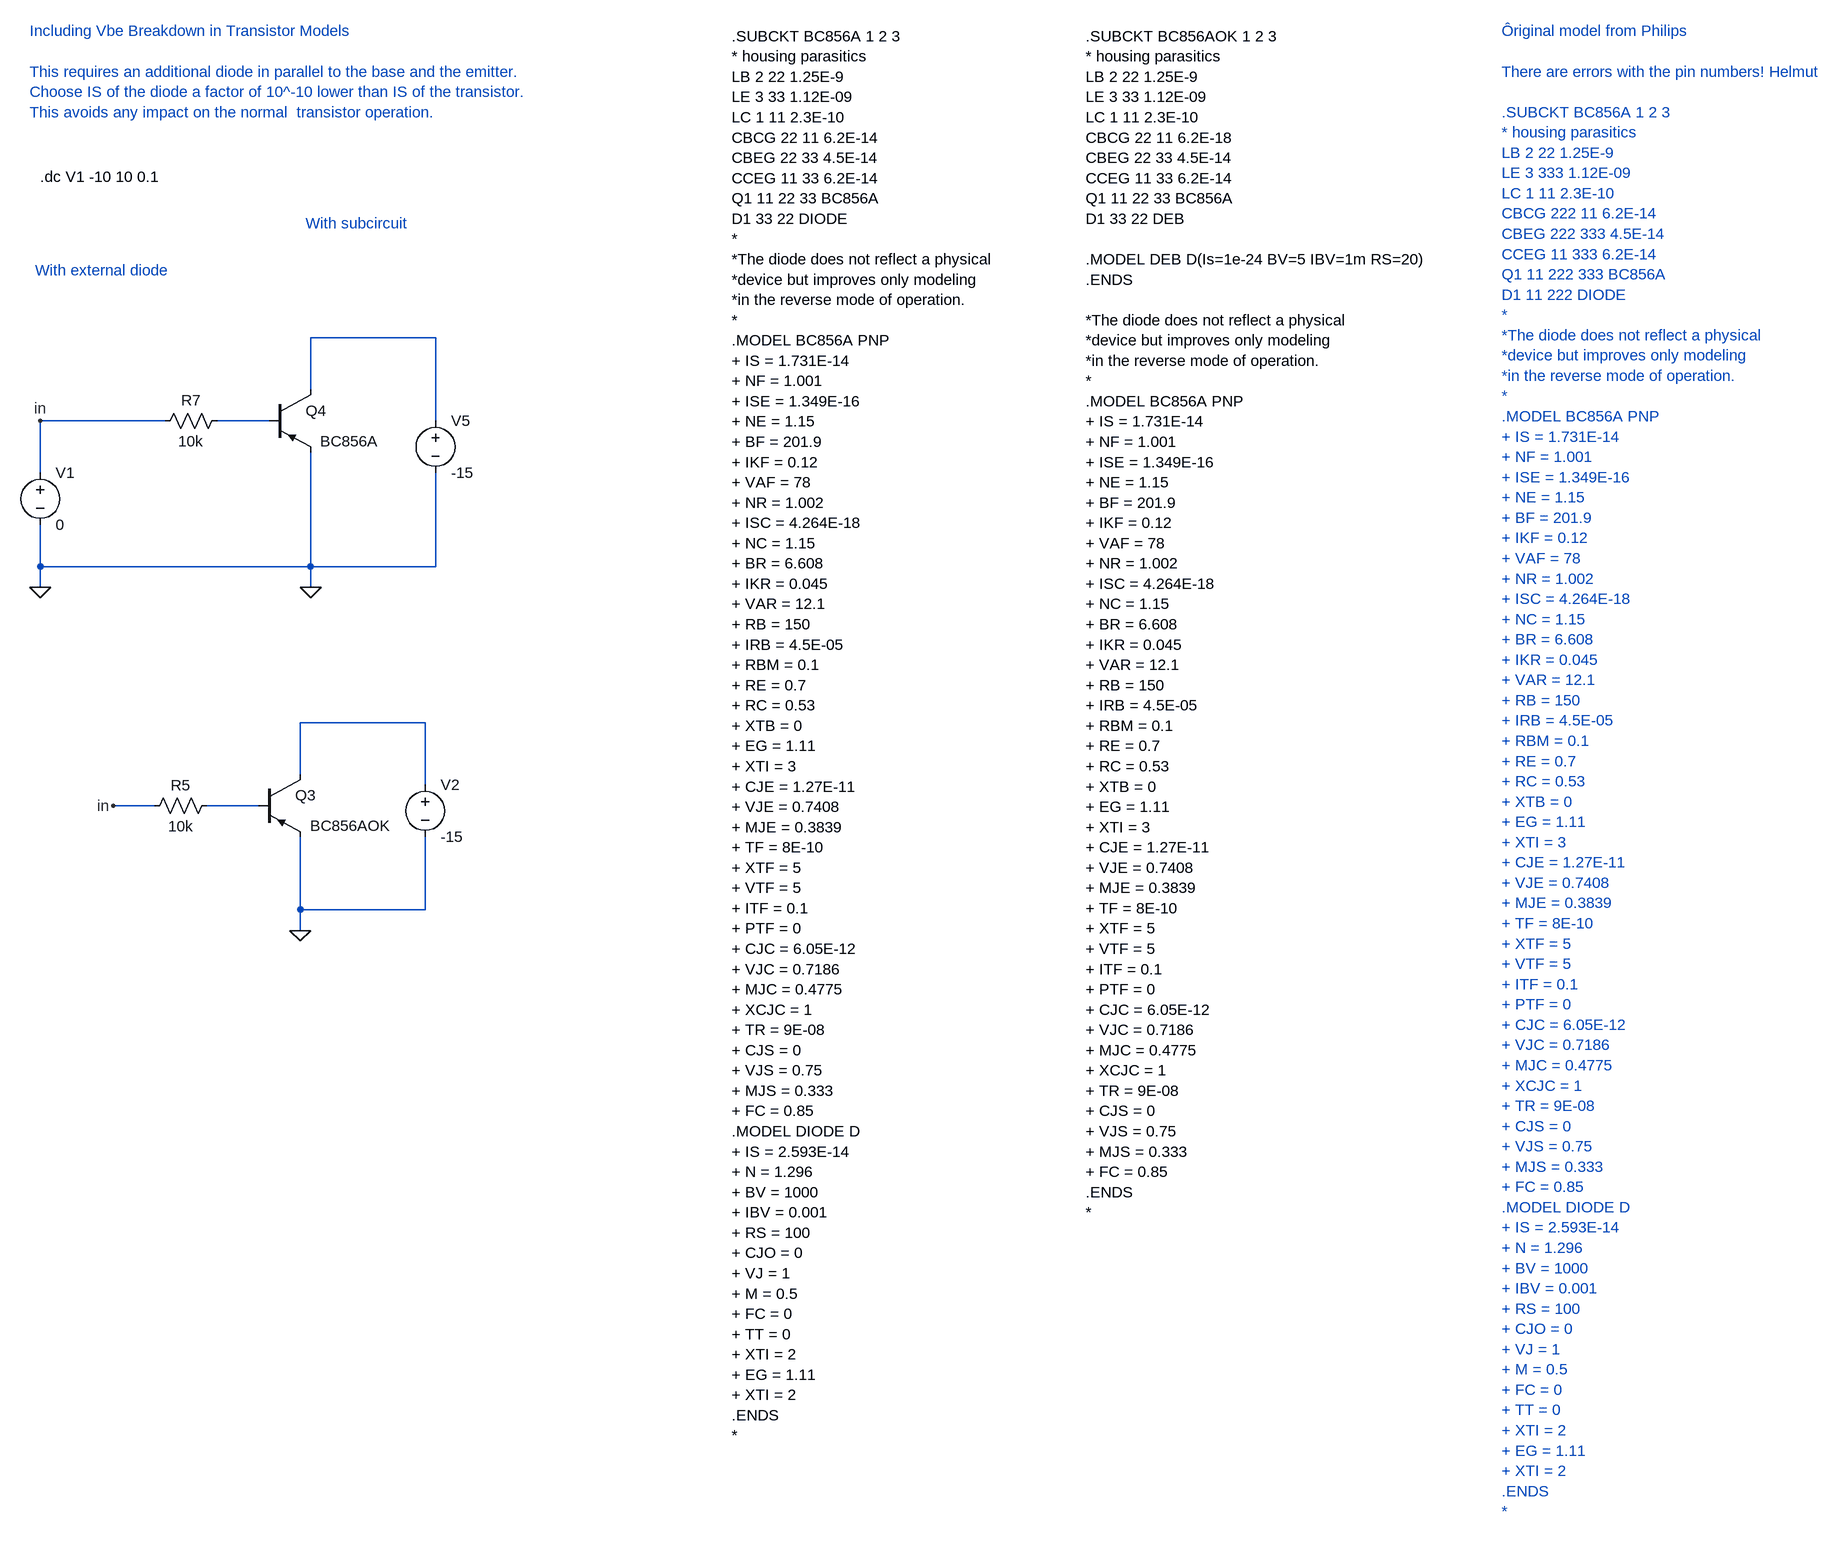
[diagram p0: schematic Vbe_break1.asc]
Vbe_break1.asc, the LTspice schematic file:
Version 4
SHEET 1 2824 2032
WIRE -128 256 -128 176
WIRE -128 400 -128 336
WIRE -128 432 -128 400
WIRE 48 768 -16 768
WIRE 64 176 -128 176
WIRE 208 768 128 768
WIRE 224 176 144 176
WIRE 272 720 272 640
WIRE 272 928 272 816
WIRE 272 960 272 928
WIRE 288 128 288 48
WIRE 288 400 -128 400
WIRE 288 400 288 224
WIRE 288 432 288 400
WIRE 464 640 272 640
WIRE 464 736 464 640
WIRE 464 928 272 928
WIRE 464 928 464 816
WIRE 480 48 288 48
WIRE 480 176 480 48
WIRE 480 400 288 400
WIRE 480 400 480 256
FLAG -128 432 0
FLAG -128 176 in
FLAG -16 768 in
FLAG 272 960 0
FLAG 288 432 0
SYMBOL voltage -128 240 R0
SYMATTR InstName V1
SYMATTR Value 0
SYMBOL res 32 784 R270
WINDOW 0 32 56 VTop 0
WINDOW 3 0 56 VBottom 0
SYMATTR InstName R5
SYMATTR Value 10k
SYMBOL pnp 208 720 R0
WINDOW 3 79 79 Left 0
SYMATTR Value BC856AOK
SYMATTR InstName Q3
SYMATTR Prefix X
SYMBOL voltage 464 720 R0
SYMATTR InstName V2
SYMATTR Value -15
SYMBOL res 48 192 R270
WINDOW 0 32 56 VTop 0
WINDOW 3 0 56 VBottom 0
SYMATTR InstName R7
SYMATTR Value 10k
SYMBOL pnp 224 128 R0
WINDOW 3 79 79 Left 0
SYMATTR Value BC856A
SYMATTR InstName Q4
SYMBOL voltage 480 160 R0
SYMATTR InstName V5
SYMATTR Value -15
TEXT -128 -200 Left 0 !.dc V1 -10 10 0.1
TEXT -136 -56 Left 0 ;With external diode
TEXT 280 -128 Left 0 ;With subcircuit
TEXT -144 -424 Left 0 ;Including Vbe Breakdown in Transistor Models\n \nThis requires an additional diode in parallel to the base and the emitter.\nChoose IS of the diode a factor of 10^-10 lower than IS of the transistor. \nThis avoids any impact on the normal  transistor operation.
TEXT 1480 -416 Left 0 !.SUBCKT BC856AOK 1 2 3\n* housing parasitics\nLB 2 22 1.25E-9\nLE 3 33 1.12E-09\nLC 1 11 2.3E-10\nCBCG 22 11 6.2E-18\nCBEG 22 33 4.5E-14\nCCEG 11 33 6.2E-14\nQ1 11 22 33 BC856A\nD1 33 22 DEB\n \n.MODEL DEB D(Is=1e-24 BV=5 IBV=1m RS=20)\n.ENDS\n \n*The diode does not reflect a physical\n*device but improves only modeling\n*in the reverse mode of operation.\n*\n.MODEL BC856A PNP\n+ IS = 1.731E-14\n+ NF = 1.001\n+ ISE = 1.349E-16\n+ NE = 1.15\n+ BF = 201.9\n+ IKF = 0.12\n+ VAF = 78\n+ NR = 1.002\n+ ISC = 4.264E-18\n+ NC = 1.15\n+ BR = 6.608\n+ IKR = 0.045\n+ VAR = 12.1\n+ RB = 150\n+ IRB = 4.5E-05\n+ RBM = 0.1\n+ RE = 0.7\n+ RC = 0.53\n+ XTB = 0\n+ EG = 1.11\n+ XTI = 3\n+ CJE = 1.27E-11\n+ VJE = 0.7408\n+ MJE = 0.3839\n+ TF = 8E-10\n+ XTF = 5\n+ VTF = 5\n+ ITF = 0.1\n+ PTF = 0\n+ CJC = 6.05E-12\n+ VJC = 0.7186\n+ MJC = 0.4775\n+ XCJC = 1\n+ TR = 9E-08\n+ CJS = 0\n+ VJS = 0.75\n+ MJS = 0.333\n+ FC = 0.85\n.ENDS\n*
TEXT 936 -416 Left 0 !.SUBCKT BC856A 1 2 3\n* housing parasitics\nLB 2 22 1.25E-9\nLE 3 33 1.12E-09\nLC 1 11 2.3E-10\nCBCG 22 11 6.2E-14\nCBEG 22 33 4.5E-14\nCCEG 11 33 6.2E-14\nQ1 11 22 33 BC856A\nD1 33 22 DIODE\n*\n*The diode does not reflect a physical\n*device but improves only modeling\n*in the reverse mode of operation.\n*\n.MODEL BC856A PNP\n+ IS = 1.731E-14\n+ NF = 1.001\n+ ISE = 1.349E-16\n+ NE = 1.15\n+ BF = 201.9\n+ IKF = 0.12\n+ VAF = 78\n+ NR = 1.002\n+ ISC = 4.264E-18\n+ NC = 1.15\n+ BR = 6.608\n+ IKR = 0.045\n+ VAR = 12.1\n+ RB = 150\n+ IRB = 4.5E-05\n+ RBM = 0.1\n+ RE = 0.7\n+ RC = 0.53\n+ XTB = 0\n+ EG = 1.11\n+ XTI = 3\n+ CJE = 1.27E-11\n+ VJE = 0.7408\n+ MJE = 0.3839\n+ TF = 8E-10\n+ XTF = 5\n+ VTF = 5\n+ ITF = 0.1\n+ PTF = 0\n+ CJC = 6.05E-12\n+ VJC = 0.7186\n+ MJC = 0.4775\n+ XCJC = 1\n+ TR = 9E-08\n+ CJS = 0\n+ VJS = 0.75\n+ MJS = 0.333\n+ FC = 0.85\n.MODEL DIODE D\n+ IS = 2.593E-14\n+ N = 1.296\n+ BV = 1000\n+ IBV = 0.001\n+ RS = 100\n+ CJO = 0\n+ VJ = 1\n+ M = 0.5\n+ FC = 0\n+ TT = 0\n+ XTI = 2\n+ EG = 1.11\n+ XTI = 2\n.ENDS\n*
TEXT 2120 -424 Left 0 ;Ôriginal model from Philips\n \nThere are errors with the pin numbers! Helmut\n \n.SUBCKT BC856A 1 2 3\n* housing parasitics\nLB 2 22 1.25E-9\nLE 3 333 1.12E-09\nLC 1 11 2.3E-10\nCBCG 222 11 6.2E-14\nCBEG 222 333 4.5E-14\nCCEG 11 333 6.2E-14\nQ1 11 222 333 BC856A\nD1 11 222 DIODE\n*\n*The diode does not reflect a physical\n*device but improves only modeling\n*in the reverse mode of operation.\n*\n.MODEL BC856A PNP\n+ IS = 1.731E-14\n+ NF = 1.001\n+ ISE = 1.349E-16\n+ NE = 1.15\n+ BF = 201.9\n+ IKF = 0.12\n+ VAF = 78\n+ NR = 1.002\n+ ISC = 4.264E-18\n+ NC = 1.15\n+ BR = 6.608\n+ IKR = 0.045\n+ VAR = 12.1\n+ RB = 150\n+ IRB = 4.5E-05\n+ RBM = 0.1\n+ RE = 0.7\n+ RC = 0.53\n+ XTB = 0\n+ EG = 1.11\n+ XTI = 3\n+ CJE = 1.27E-11\n+ VJE = 0.7408\n+ MJE = 0.3839\n+ TF = 8E-10\n+ XTF = 5\n+ VTF = 5\n+ ITF = 0.1\n+ PTF = 0\n+ CJC = 6.05E-12\n+ VJC = 0.7186\n+ MJC = 0.4775\n+ XCJC = 1\n+ TR = 9E-08\n+ CJS = 0\n+ VJS = 0.75\n+ MJS = 0.333\n+ FC = 0.85\n.MODEL DIODE D\n+ IS = 2.593E-14\n+ N = 1.296\n+ BV = 1000\n+ IBV = 0.001\n+ RS = 100\n+ CJO = 0\n+ VJ = 1\n+ M = 0.5\n+ FC = 0\n+ TT = 0\n+ XTI = 2\n+ EG = 1.11\n+ XTI = 2\n.ENDS\n*

The netlist it stands for:
* Vbe_break1.asc
V1 in 0 0
R5 in N001 10k
XQ3 N003 N001 0 BC856AOK  ; pins C B E
V2 N003 0 -15
R7 in N002 10k
Q4 N004 N002 0 0 BC856A
V5 N004 0 -15
.model NPN NPN
.model PNP PNP
.lib standard.bjt
.dc V1 -10 10 0.1
* With external diode
* With subcircuit
* Including Vbe Breakdown in Transistor Models
* This requires an additional diode in parallel to the base and the emitter.
* Choose IS of the diode a factor of 10^-10 lower than IS of the transistor.
* This avoids any impact on the normal  transistor operation.
.SUBCKT BC856AOK 1 2 3
* housing parasitics
LB 2 22 1.25E-9
LE 3 33 1.12E-09
LC 1 11 2.3E-10
CBCG 22 11 6.2E-18
CBEG 22 33 4.5E-14
CCEG 11 33 6.2E-14
Q1 11 22 33 BC856A
D1 33 22 DEB
.MODEL DEB D(Is=1e-24 BV=5 IBV=1m RS=20)
.ENDS
*The diode does not reflect a physical
*device but improves only modeling
*in the reverse mode of operation.
*
.MODEL BC856A PNP
+ IS = 1.731E-14
+ NF = 1.001
+ ISE = 1.349E-16
+ NE = 1.15
+ BF = 201.9
+ IKF = 0.12
+ VAF = 78
+ NR = 1.002
+ ISC = 4.264E-18
+ NC = 1.15
+ BR = 6.608
+ IKR = 0.045
+ VAR = 12.1
+ RB = 150
+ IRB = 4.5E-05
+ RBM = 0.1
+ RE = 0.7
+ RC = 0.53
+ XTB = 0
+ EG = 1.11
+ XTI = 3
+ CJE = 1.27E-11
+ VJE = 0.7408
+ MJE = 0.3839
+ TF = 8E-10
+ XTF = 5
+ VTF = 5
+ ITF = 0.1
+ PTF = 0
+ CJC = 6.05E-12
+ VJC = 0.7186
+ MJC = 0.4775
+ XCJC = 1
+ TR = 9E-08
+ CJS = 0
+ VJS = 0.75
+ MJS = 0.333
+ FC = 0.85
.ENDS
*
.SUBCKT BC856A 1 2 3
* housing parasitics
LB 2 22 1.25E-9
LE 3 33 1.12E-09
LC 1 11 2.3E-10
CBCG 22 11 6.2E-14
CBEG 22 33 4.5E-14
CCEG 11 33 6.2E-14
Q1 11 22 33 BC856A
D1 33 22 DIODE
*
*The diode does not reflect a physical
*device but improves only modeling
*in the reverse mode of operation.
*
.MODEL BC856A PNP
+ IS = 1.731E-14
+ NF = 1.001
+ ISE = 1.349E-16
+ NE = 1.15
+ BF = 201.9
+ IKF = 0.12
+ VAF = 78
+ NR = 1.002
+ ISC = 4.264E-18
+ NC = 1.15
+ BR = 6.608
+ IKR = 0.045
+ VAR = 12.1
+ RB = 150
+ IRB = 4.5E-05
+ RBM = 0.1
+ RE = 0.7
+ RC = 0.53
+ XTB = 0
+ EG = 1.11
+ XTI = 3
+ CJE = 1.27E-11
+ VJE = 0.7408
+ MJE = 0.3839
+ TF = 8E-10
+ XTF = 5
+ VTF = 5
+ ITF = 0.1
+ PTF = 0
+ CJC = 6.05E-12
+ VJC = 0.7186
+ MJC = 0.4775
+ XCJC = 1
+ TR = 9E-08
+ CJS = 0
+ VJS = 0.75
+ MJS = 0.333
+ FC = 0.85
.MODEL DIODE D
+ IS = 2.593E-14
+ N = 1.296
+ BV = 1000
+ IBV = 0.001
+ RS = 100
+ CJO = 0
+ VJ = 1
+ M = 0.5
+ FC = 0
+ TT = 0
+ XTI = 2
+ EG = 1.11
+ XTI = 2
.ENDS
*
* Ôriginal model from Philips
* There are errors with the pin numbers! Helmut
* .SUBCKT BC856A 1 2 3
* * housing parasitics
* LB 2 22 1.25E-9
* LE 3 333 1.12E-09
* LC 1 11 2.3E-10
* CBCG 222 11 6.2E-14
* CBEG 222 333 4.5E-14
* CCEG 11 333 6.2E-14
* Q1 11 222 333 BC856A
* D1 11 222 DIODE
* *
* *The diode does not reflect a physical
* *device but improves only modeling
* *in the reverse mode of operation.
* *
* .MODEL BC856A PNP
* + IS = 1.731E-14
* + NF = 1.001
* + ISE = 1.349E-16
* + NE = 1.15
* + BF = 201.9
* + IKF = 0.12
* + VAF = 78
* + NR = 1.002
* + ISC = 4.264E-18
* + NC = 1.15
* + BR = 6.608
* + IKR = 0.045
* + VAR = 12.1
* + RB = 150
* + IRB = 4.5E-05
* + RBM = 0.1
* + RE = 0.7
* + RC = 0.53
* + XTB = 0
* + EG = 1.11
* + XTI = 3
* + CJE = 1.27E-11
* + VJE = 0.7408
* + MJE = 0.3839
* + TF = 8E-10
* + XTF = 5
* + VTF = 5
* + ITF = 0.1
* + PTF = 0
* + CJC = 6.05E-12
* + VJC = 0.7186
* + MJC = 0.4775
* + XCJC = 1
* + TR = 9E-08
* + CJS = 0
* + VJS = 0.75
* + MJS = 0.333
* + FC = 0.85
* .MODEL DIODE D
* + IS = 2.593E-14
* + N = 1.296
* + BV = 1000
* + IBV = 0.001
* + RS = 100
* + CJO = 0
* + VJ = 1
* + M = 0.5
* + FC = 0
* + TT = 0
* + XTI = 2
* + EG = 1.11
* + XTI = 2
* .ENDS
* *
.backanno
.end